# EAGLE design TideGauge (EAGLE 9.6.2)
AUTHOR: Alexander Dunn; BOARD_NAME: Electronics Schematic; PROJECT_NAME: Tide Gauge
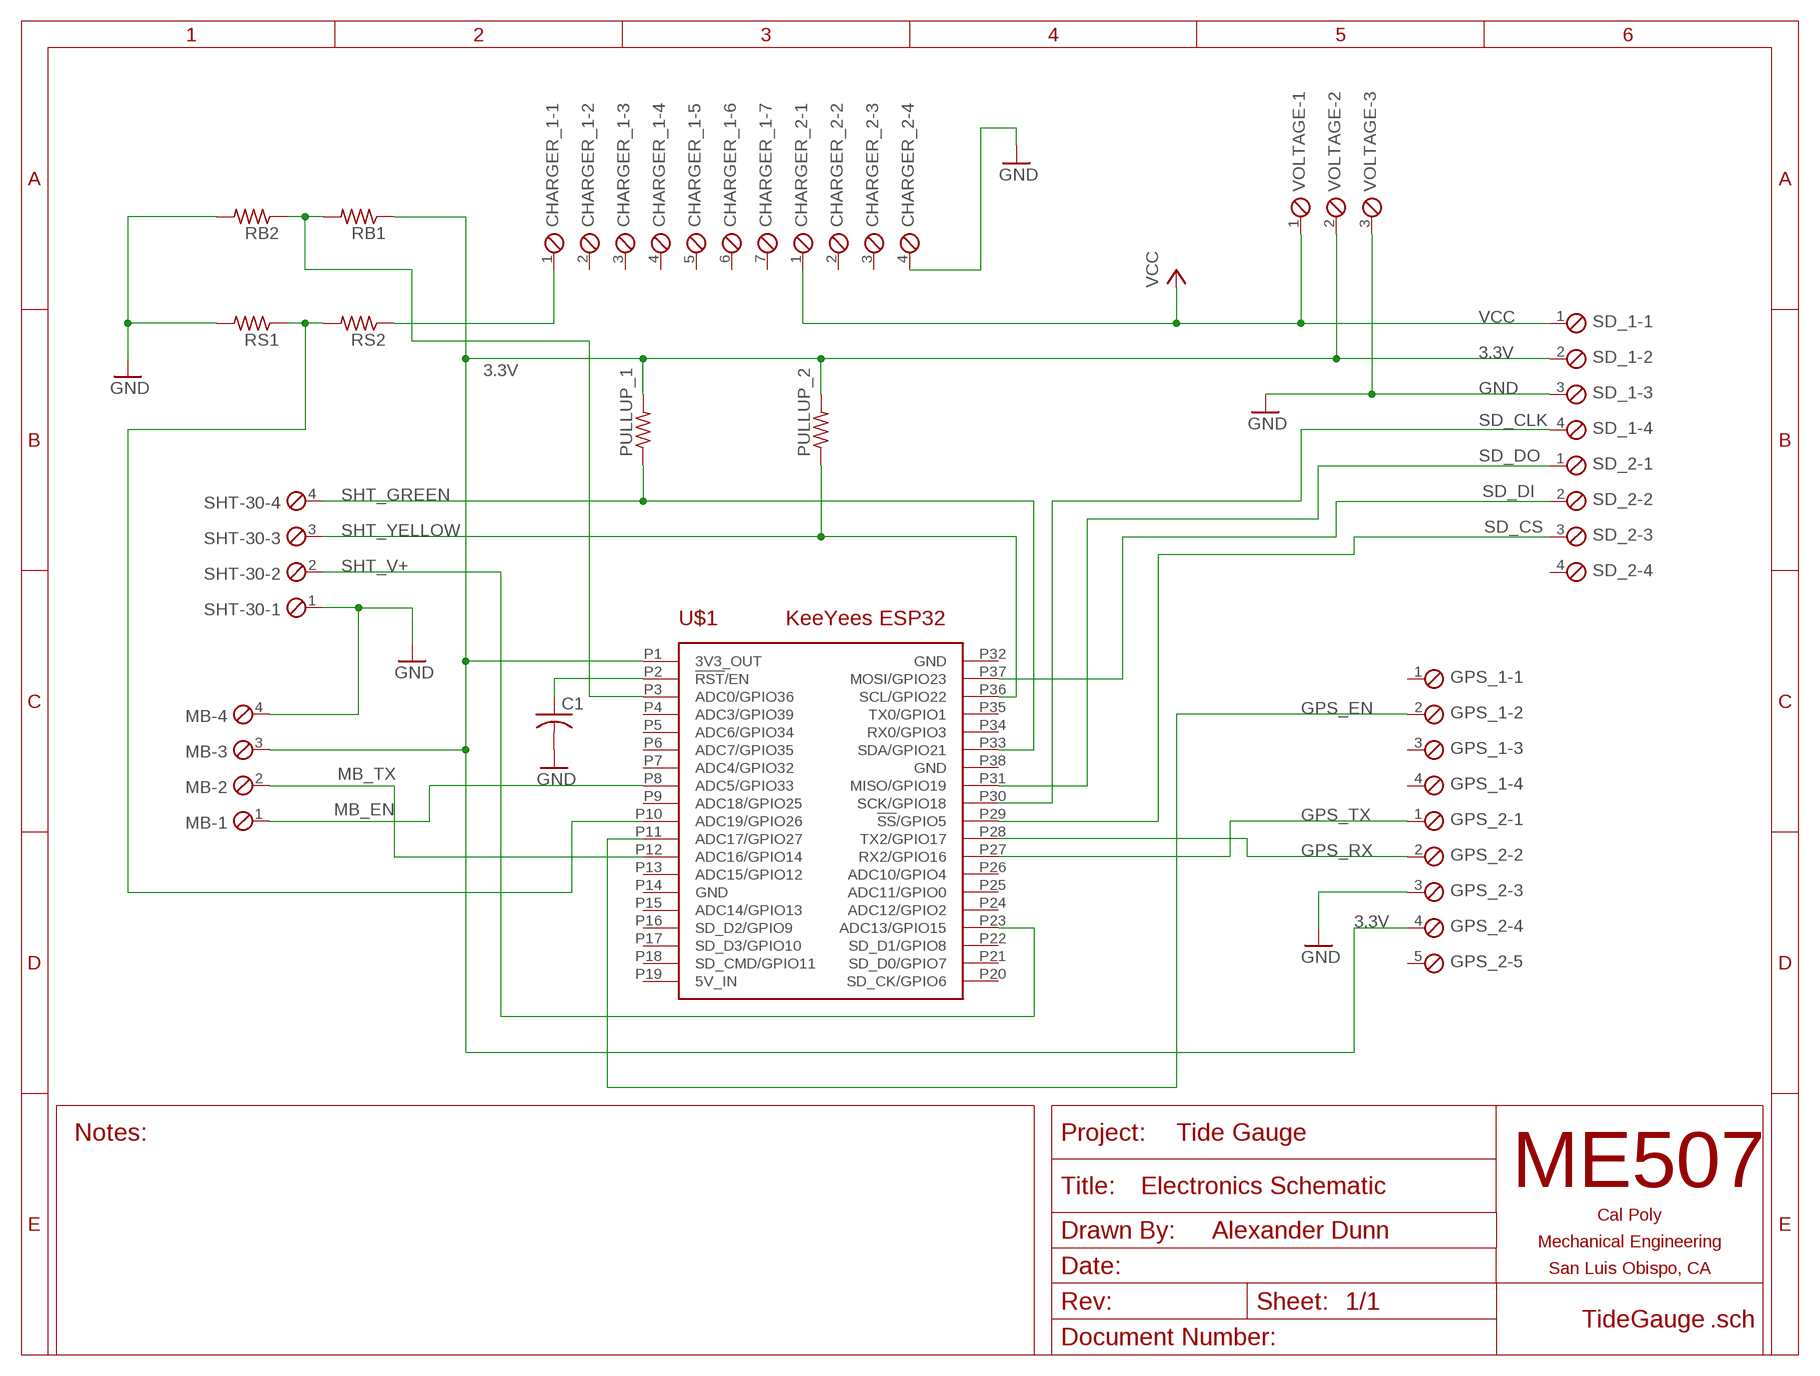
[diagram p0: schematic, sheet 1]

## Parts
C1  C-USC0805  [C0805]
CHARGER_1  SCREWTERM_7P_254  [7POL254]
CHARGER_2  SCREWTERM_4P_254  [4POL254]
GPS_1  SCREWTERM_4P_254  [4POL254]
GPS_2  SCREWTERM_5P_254  [5POL254]
MB  SCREWTERM_4P_254  [4POL254]
PULLUP_1  R-US_M0805  [M0805]
PULLUP_2  R-US_M0805  [M0805]
RB1  R-US_R0805  [R0805]
RB2  R-US_R0805  [R0805]
RS1  R-US_R0805  [R0805]
RS2  R-US_R0805  [R0805]
SD_1  SCREWTERM_4P_254  [4POL254]
SD_2  SCREWTERM_4P_254  [4POL254]
SHT-30  SCREWTERM_4P_254  [4POL254]
U$1  KEEYEES_ESP32  [KEEYEES_ESP32]
VOLTAGE  SCREWTERM_3P_254  [3POL254]

## Nets
3.3V: GPS_2.4 MB.3 PULLUP_1.2 PULLUP_2.2 RB1.1 SD_1.2 U$1.P1(3V3_OUT) VOLTAGE.2
GND: C1.2 CHARGER_2.4 GPS_2.3 MB.4 RB2.2 RS1.2 SD_1.3 SHT-30.1 VOLTAGE.3
GPS_EN: GPS_1.2 U$1.P11(ADC17/GPIO27)
GPS_RX: GPS_2.2 U$1.P28(TX2/GPIO17)
GPS_TX: GPS_2.1 U$1.P27(RX2/GPIO16)
MB_EN: MB.1 U$1.P8(ADC5/GPIO33)
MB_TX: MB.2 U$1.P12(ADC16/GPIO14)
N$1: C1.1 U$1.P2(!RST!/EN)
N$2: CHARGER_1.1 RS2.1
N$3: RS1.1 RS2.2 U$1.P10(ADC19/GPIO26)
N$4: RB1.2 RB2.1 U$1.P3(ADC0/GPIO36)
SD_CLK: SD_1.4 U$1.P30(SCK/GPIO18)
SD_CS: SD_2.3 U$1.P29(!SS!/GPIO5)
SD_DI: SD_2.2 U$1.P37(MOSI/GPIO23)
SD_DO: SD_2.1 U$1.P31(MISO/GPIO19)
SHT_GREEN: PULLUP_1.1 SHT-30.4 U$1.P33(SDA/GPIO21)
SHT_V+: SHT-30.2 U$1.P23(ADC13/GPIO15)
SHT_YELLOW: PULLUP_2.1 SHT-30.3 U$1.P36(SCL/GPIO22)
VCC: CHARGER_2.1 SD_1.1 VOLTAGE.1
Unconnected: CHARGER_1.2 CHARGER_1.3 CHARGER_1.4 CHARGER_1.5 CHARGER_1.6 CHARGER_1.7 CHARGER_2.2 CHARGER_2.3 GPS_1.1 GPS_1.3 GPS_1.4 GPS_2.5 SD_2.4 U$1.P4(ADC3/GPIO39) U$1.P5(ADC6/GPIO34) U$1.P6(ADC7/GPIO35) U$1.P7(ADC4/GPIO32) U$1.P9(ADC18/GPIO25) U$1.P13(ADC15/GPIO12) U$1.P15(ADC14/GPIO13) U$1.P16(SD_D2/GPIO9) U$1.P17(SD_D3/GPIO10) U$1.P18(SD_CMD/GPIO11) U$1.P20(SD_CK/GPIO6) U$1.P21(SD_D0/GPIO7) U$1.P22(SD_D1/GPIO8) U$1.P24(ADC12/GPIO2) U$1.P25(ADC11/GPIO0) U$1.P26(ADC10/GPIO4) U$1.P34(RX0/GPIO3) U$1.P35(TX0/GPIO1)

## Power pins joined to a net without a drawn wire
5V_IN: U$1.P19(5V_IN)
GND: U$1.P14(GND) U$1.P32(GND) U$1.P38(GND)

## Library data of the parts
C1 = rcl:C-US: CAPACITOR, American symbol; SPICEPREFIX: C
CHARGER_1 = ME507:SCREWTERM_7P: Screw Terminal Block This part is designed for a screw terminal connector. The 2.54mm (0.100 inch) foorprint can also be used for male or female pin headers such as those on most development boards. One can also solder wires directly into the holes, though this makes modifications or repairs to the system more inconvenient. Larger versions can carry more current.
CHARGER_2 GPS_1 MB SD_1 SD_2 SHT-30 = ME507:SCREWTERM_4P: Screw Terminal Block This part is designed for a screw terminal connector. The 2.54mm (0.100 inch) foorprint can also be used for male or female pin headers such as those on most development boards. One can also solder wires directly into the holes, though this makes modifications or repairs to the system more inconvenient. Larger versions can carry more current.
GPS_2 = ME507:SCREWTERM_5P: Screw Terminal Block This part is designed for a screw terminal connector. The 2.54mm (0.100 inch) foorprint can also be used for male or female pin headers such as those on most development boards. One can also solder wires directly into the holes, though this makes modifications or repairs to the system more inconvenient. Larger versions can carry more current.
PULLUP_1 PULLUP_2 RB1 RB2 RS1 RS2 = rcl:R-US_: RESISTOR, American symbol; SPICEPREFIX: R
U$1 = ME507:KEEYEES_ESP32: Footprint for an add-on board (shield, hat, etc.) for a KeeYees ESP32 development board with ESP-WROOM-32 module. 38 pins.
VOLTAGE = ME507:SCREWTERM_3P: Screw Terminal Block This part is designed for a screw terminal connector. The 2.54mm (0.100 inch) foorprint can also be used for male or female pin headers such as those on most development boards. One can also solder wires directly into the holes, though this makes modifications or repairs to the system more inconvenient. Larger versions can carry more current.

## Board
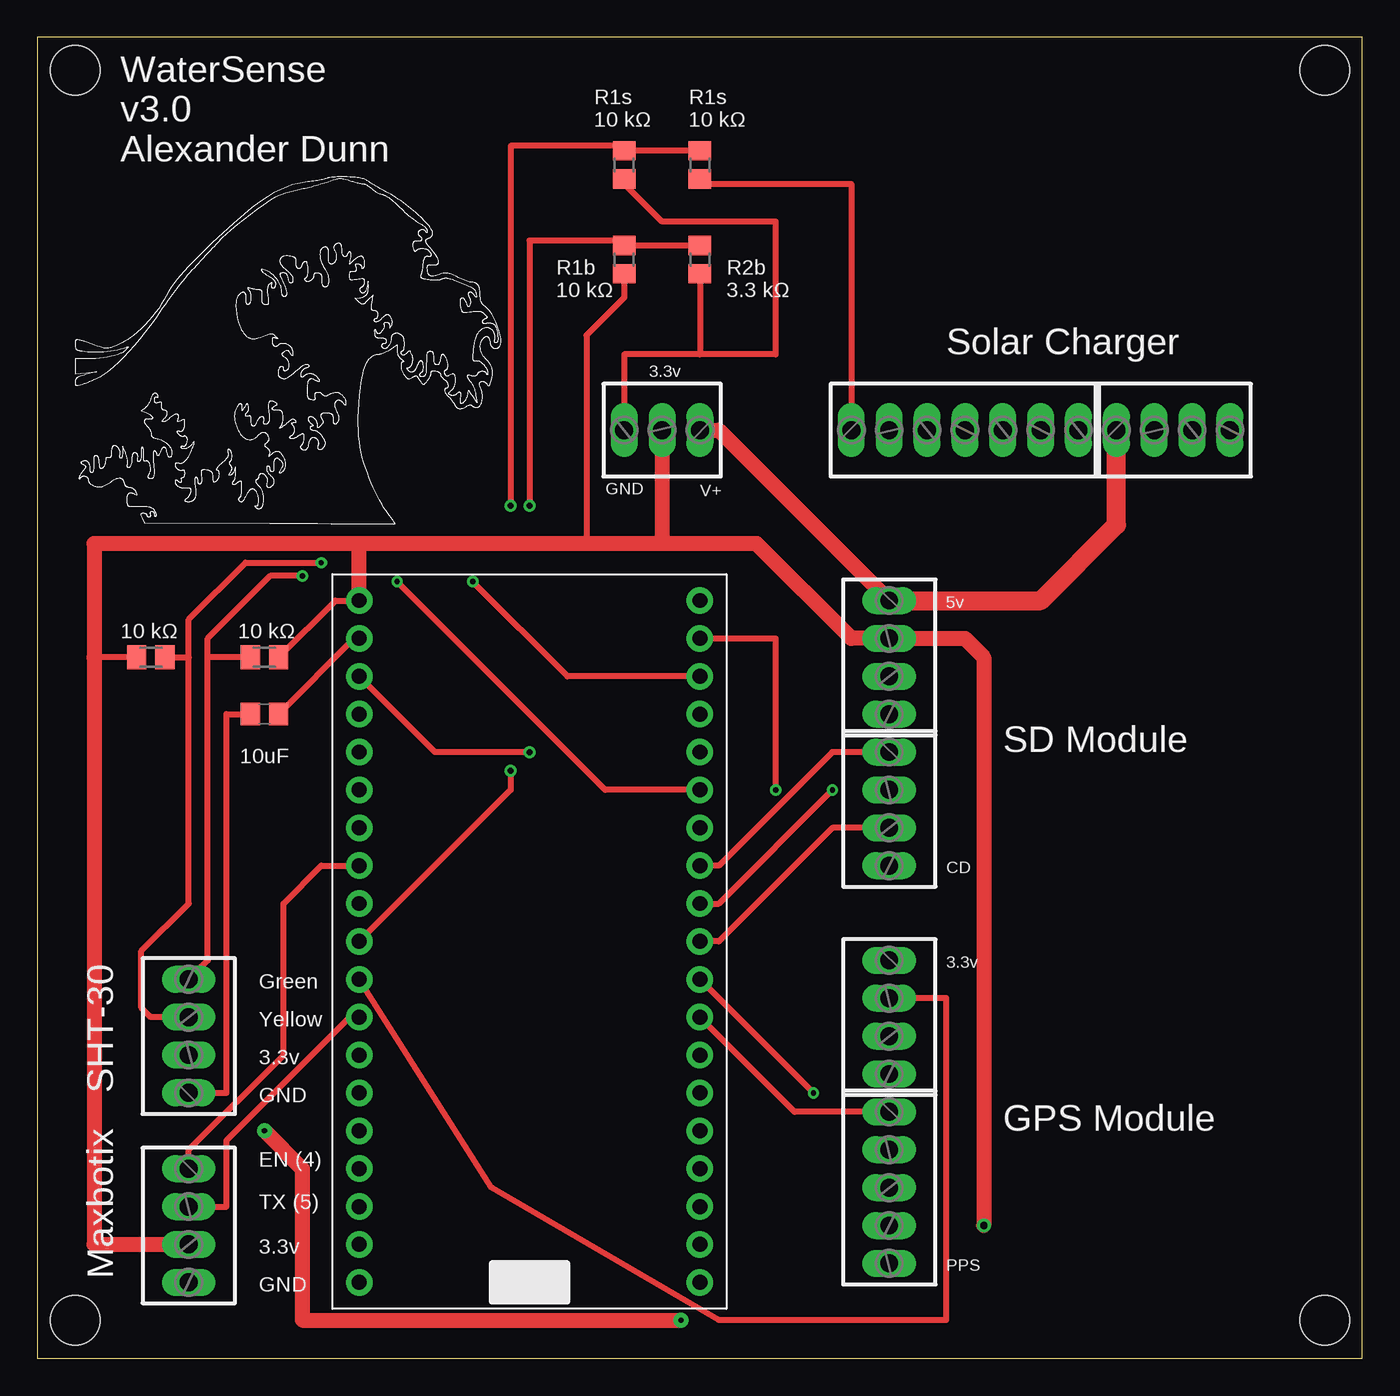
[diagram p1: board, top side]
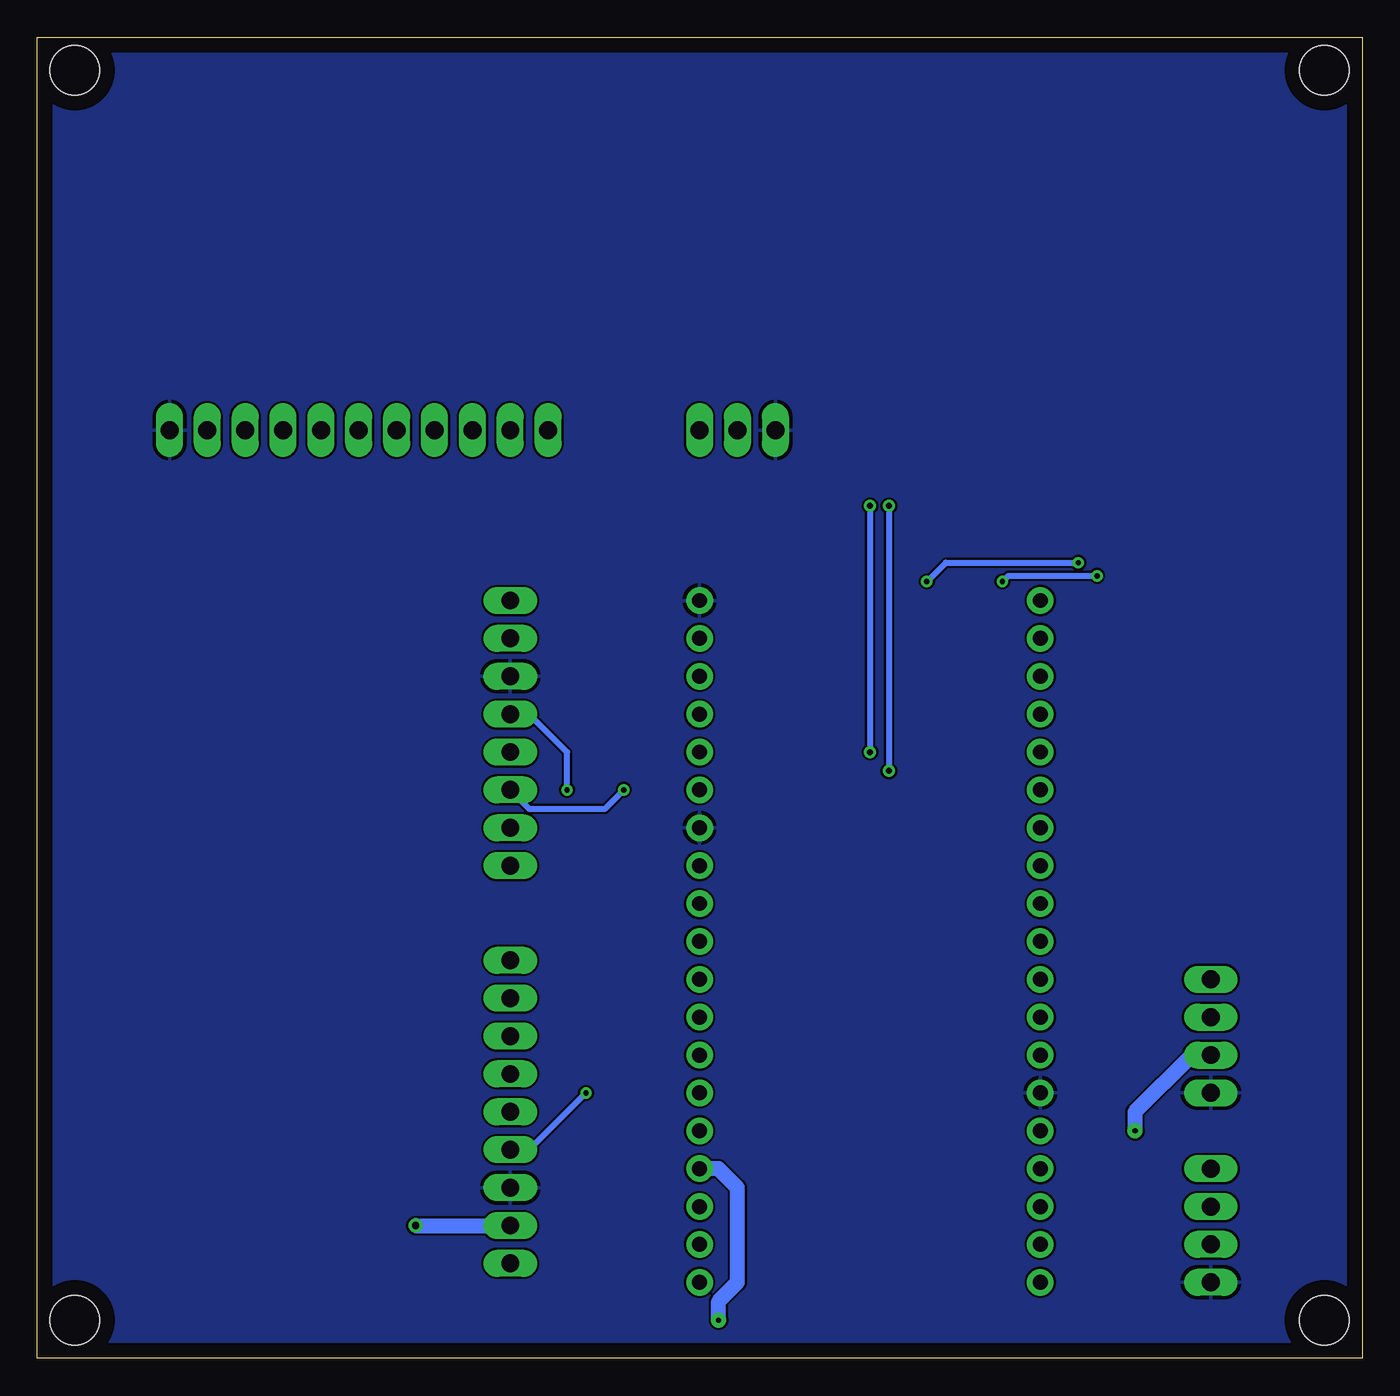
[diagram p2: board, bottom side, seen from below]

Size 88.88 x 88.59 mm. Coordinates in mm from the lower left corner, seen from the top.
Outline: 0,2.42 0,88.59 88.88,88.59 88.88,0.02 0,0 0,2.42
Outline: 0,2.42 arc11 0,2.4
Copper layers (1*16): Top 0.035mm / dielectric 1.5mm / Bottom 0.035mm
Design rules "default": minimum track width 6mil, minimum drill 0.35mm, track to track 6mil, track to pad 6mil, pad to pad 6mil, via to via 6mil, smd to smd 6mil, copper to edge 40mil, drill to drill 6mil, minimum pad ring 10mil, minimum via ring 8mil, stop-mask expansion 4mil, vias tented up to drill 0mil, thermal gap 10mil
Holes 3.3 mm at 86.36,86.38 86.36,2.56 2.54,2.56 2.54,86.38

### Footprints (pad centres in the part's own frame; a part is rotated, then mirrored left to right if it is on the bottom)
C0805 = smd 1.3 x 1.5: 1 -0.95,0; 2 0.95,0
7POL254 = drill 1.2 long: 1 -7.62,0; 2 -5.08,0; 3 -2.54,0; 4 0,0; 5 2.54,0; 6 5.08,0; 7 7.62,0
4POL254 = drill 1.2 long: 1 -3.81,0; 2 -1.27,0; 3 1.27,0; 4 3.81,0
5POL254 = drill 1.2 long: 1 -5.08,0; 2 -2.54,0; 3 0,0; 4 2.54,0; 5 5.08,0
M0805 = smd 1.3 x 1.6: 1 -0.95,0; 2 0.95,0
R0805 = smd 1.3 x 1.5: 1 -0.95,0; 2 0.95,0
KEEYEES_ESP32 = drill 1 pad 1.778: P1 -11.43,21.59; P2 -11.43,19.05; P3 -11.43,16.51; P4 -11.43,13.97; P5 -11.43,11.43; P6 -11.43,8.89; P7 -11.43,6.35; P8 -11.43,3.81; P9 -11.43,1.27; P10 -11.43,-1.27; P11 -11.43,-3.81; P12 -11.43,-6.35; P13 -11.43,-8.89; P14 -11.43,-11.43; P15 -11.43,-13.97; P16 -11.43,-16.51; P17 -11.43,-19.05; P18 -11.43,-21.59; P19 -11.43,-24.13; P20 11.43,-24.13; P21 11.43,-21.59; P22 11.43,-19.05; P23 11.43,-16.51; P24 11.43,-13.97; P25 11.43,-11.43; P26 11.43,-8.89; P27 11.43,-6.35; P28 11.43,-3.81; P29 11.43,-1.27; P30 11.43,1.27; P31 11.43,3.81; P32 11.43,6.35; P33 11.43,8.89; P34 11.43,11.43; P35 11.43,13.97; P36 11.43,16.51; P37 11.43,19.05; P38 11.43,21.59
3POL254 = drill 1.2 long: 1 -2.54,0; 2 0,0; 3 2.54,0

### Placement (x,y rotation side)
C1  15.24,43.2 180 top
CHARGER_1  62.23,62.25 0 top
CHARGER_2  76.2,62.25 0 top
GPS_1  57.15,22.88 270 top
GPS_2  57.15,11.45 270 top
MB  10.16,8.91 270 top
PULLUP_1  15.24,47.01 0 top
PULLUP_2  7.62,47.01 180 top
RB1  39.37,73.68 90 top
RB2  44.45,73.68 270 top
RS1  39.37,80.03 270 top
RS2  44.45,80.03 90 top
SD_1  57.15,47.01 270 top
SD_2  57.15,36.85 270 top
SHT-30  10.16,21.61 90 top
U$1  33.02,29.23 0 top
VOLTAGE  41.91,62.25 180 top

### Tracks (layer width: path | path; a pad name or v marks a point on that pad's centre or on a via)
3.3V  (via drill 0.5)
  Top 0.406: PULLUP_1.2 20,50.82 U$1.P1 | PULLUP_2.2 3.81,47.01 | RB1.1 39.37,71.14 36.83,68.6 36.83,54.63
  Top 1.016: 41.91,54.63 48.26,54.63 54.61,48.28 SD_1.2 62.23,48.28 63.5,47.01 v63.5,8.91 | 41.91,54.63 36.83,54.63 21.59,54.63 | U$1.P1 21.59,54.63 | VOLTAGE.2 41.91,54.63 | 21.59,54.63 3.81,54.63 3.81,47.01 3.81,7.64 MB.3
  Bottom 1.016: v63.5,8.91 GPS_2.4
GND
  Top 0.406: 44.45,67.33 49.53,67.33 49.53,76.22 41.91,76.22 39.37,78.76 RS1.2 | 44.45,67.33 39.37,67.33 VOLTAGE.3 | RB2.2 44.45,67.33 | SHT-30.1 12.7,17.8 12.7,43.2 C1.2
  pour Bottom (rank 6): 0,88.92 88.9,88.92 88.9,0.02 0,0.02
GPS_EN
  Top 0.406: GPS_1.2 60.96,24.15 60.96,2.56 45.72,2.56 30.48,11.45 U$1.P11
GPS_RX  (via drill 0.35)
  Top 0.406: v52.07,17.8 U$1.P28
  Bottom 0.406: v52.07,17.8 55.88,13.99 GPS_2.2
GPS_TX
  Top 0.406: GPS_2.1 50.8,16.53 U$1.P27
MB_EN
  Top 0.406: MB.1 10.16,13.99 16.51,20.34 16.51,30.5 19.05,33.04 U$1.P8
MB_TX
  Top 0.406: MB.2 12.7,10.18 12.7,14.62 20.96,22.88 U$1.P12
N$1
  Top 0.406: C1.1 21.27,48.28 U$1.P2
N$2
  Top 0.406: RS2.1 44.77,78.76 54.61,78.76 CHARGER_1.1
N$3  (via drill 0.4)
  Top 0.406: RS2.2 RS1.1 39.05,81.3 31.75,81.3 v31.75,57.17 | v31.75,39.39 31.75,38.12 U$1.P10
  Bottom 0.406: v31.75,57.17 v31.75,39.39
N$4  (via drill 0.4)
  Top 0.406: v33.02,57.17 33.02,74.95 39.05,74.95 RB1.2 RB2.1 | v33.02,40.66 26.67,40.66 U$1.P3
  Bottom 0.406: v33.02,57.17 v33.02,40.66
SD_CLK  (via drill 0.35)
  Top 0.406: U$1.P30 45.72,30.5 v53.34,38.12
  Bottom 0.406: v53.34,38.12 53.34,40.66 55.88,43.2 SD_1.4
SD_CS
  Top 0.406: SD_2.3 53.34,35.58 45.72,27.96 U$1.P29
SD_DI  (via drill 0.35)
  Top 0.406: U$1.P37 49.53,48.28 v49.53,38.12
  Bottom 0.406: SD_2.2 55.88,36.85 50.8,36.85 v49.53,38.12
SD_DO
  Top 0.406: SD_2.1 53.34,40.66 45.72,33.04 U$1.P31
SHT_GREEN  (via drill 0.35)
  Top 0.406: U$1.P33 38.1,38.12 v24.13,52.09 | v17.78,52.47 15.62,52.47 11.43,48.28 11.43,47.01 | SHT-30.4 11.43,26.69 11.43,47.01 | PULLUP_1.1 11.43,47.01
  Bottom 0.406: v24.13,52.09 23.75,52.47 v17.78,52.47
SHT_V+  (via drill 0.35 pad 1)
  Top 1.016: v15.24,15.26 17.78,12.72 17.78,2.56 v43.18,2.56
  Bottom 1.016: SHT-30.2 11.43,20.34 15.24,16.53 v15.24,15.26 | v43.18,2.56 43.18,3.83 41.91,5.1 41.91,11.45 43.18,12.72 U$1.P23
SHT_YELLOW  (via drill 0.35)
  Top 0.406: U$1.P36 35.56,45.74 v29.21,52.09 | v19.05,53.36 13.97,53.36 10.16,49.55 10.16,47.01 | SHT-30.3 7.62,22.88 6.99,23.51 6.99,27.32 10.16,30.5 10.16,47.01 | PULLUP_2.1 10.16,47.01
  Bottom 0.406: v29.21,52.09 27.94,53.36 v19.05,53.36
VCC
  Top 1.016: VOLTAGE.1 45.72,62.25 SD_1.1
  Top 1.27: SD_1.1 67.31,50.82 72.39,55.9 CHARGER_2.1

### Text on the board
tNames: R1s / 10 kΩ | R1s / 10 kΩ | WaterSense / v3.0 / Alexander Dunn | R1b / 10 kΩ | R2b / 3.3 kΩ | Solar Charger | 3.3v | GND | V+ | 5v | 10 kΩ | 10 kΩ | SD Module | 10uF | CD | 3.3v | Green | Yellow | 3.3v | SHT-30 | GND | GPS Module | EN (4) | TX (5) | 3.3v | PPS | Maxbotix | GND